# Altium schematic sheet Control System.SchDoc
size A4; DocumentNumber: 2; SheetNumber: 2; SheetTotal: 2
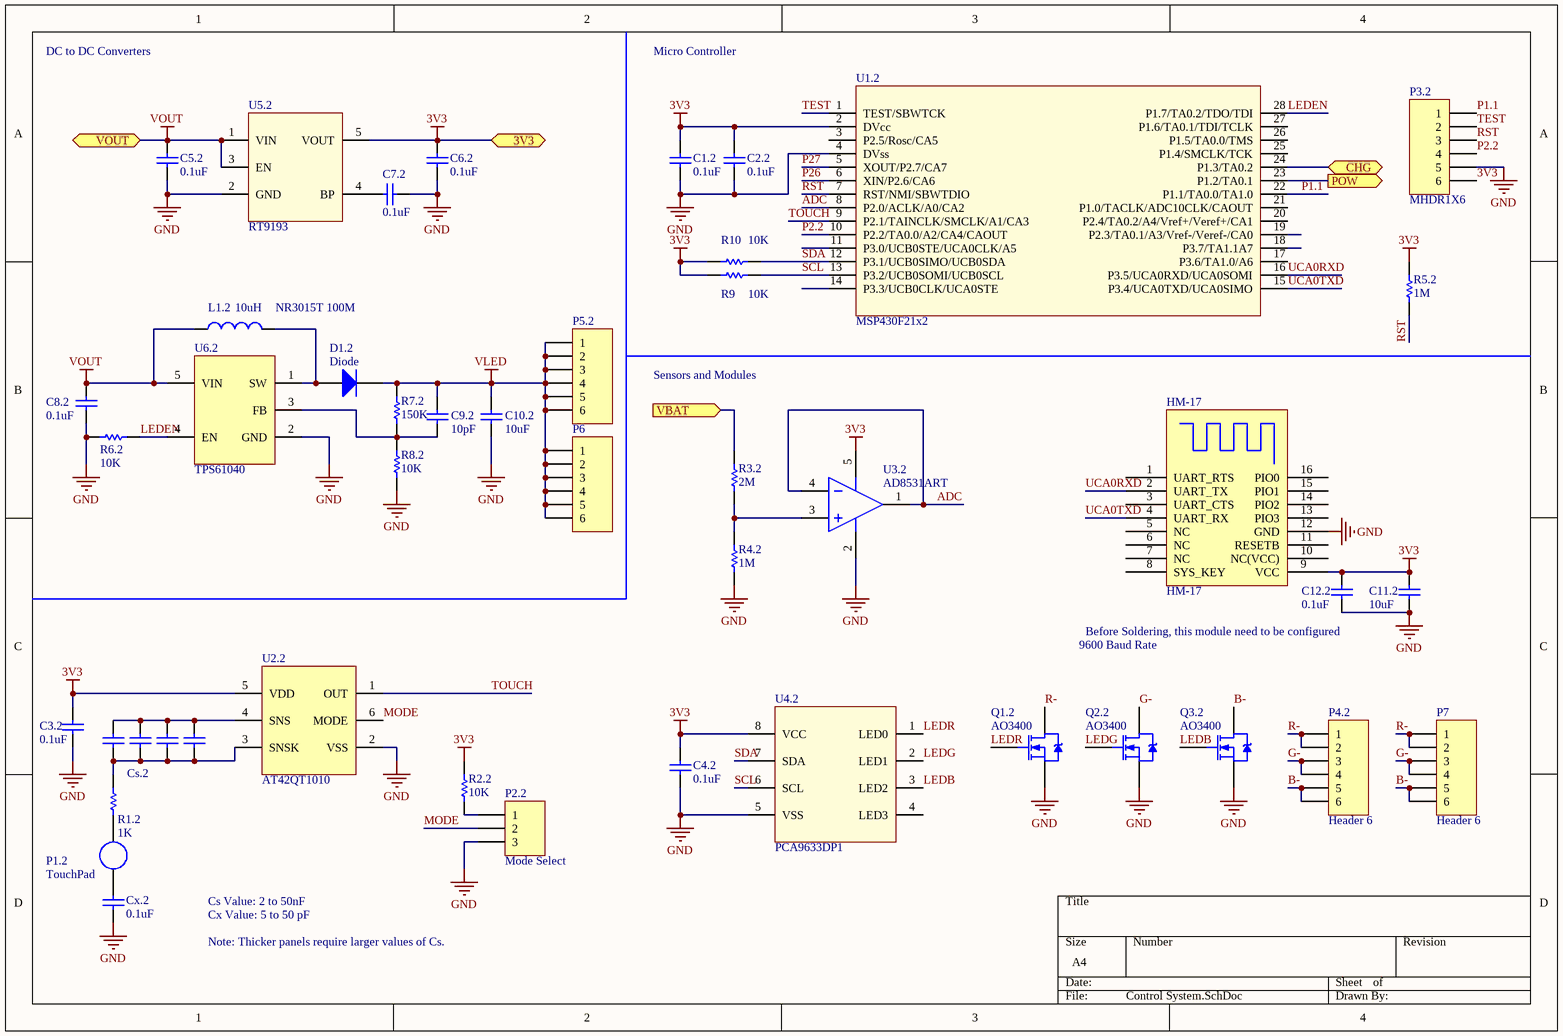
[diagram p0: Control System.SchDoc]

## Parts
C1.2  value 0.1uF  [D0603]  (hidden comment: 0603)
C2.2  value 0.1uF  [D0603]  (hidden comment: 0603)
C3.2  value 0.1uF  [D0603]  (hidden comment: 0603)
C4.2  value 0.1uF  [D0603]  (hidden comment: 0603)
C5.2  value 0.1uF  [D0603]  (hidden comment: 0603)
C6.2  value 0.1uF  [D0603]  (hidden comment: 0603)
C7.2  value 0.1uF  [D0603]  (hidden comment: 0603)
C8.2  value 0.1uF  [D0603]  (hidden comment: 0603)
C9.2  value 10pF  [D0603]  (hidden comment: 0603)
C10.2  value 10uF  [D0805]  (hidden comment: 0603)
C11.2  value 10uF  [D0603]  (hidden comment: 0603)
C12.2  value 0.1uF  [D0603]  (hidden comment: 0603)
Cs1  0603  [D0603]  (value not drawn)
Cs2  0603  [D0603]  (value not drawn)
Cs3  0603  [D0603]  (value not drawn)
Cs.2  0603  [D0603]  (value not drawn)
Cx.2  value 0.1uF  [D0603]  (hidden comment: 0603)
D1.2  Diode  [DO214AC_SMA]
HM-17  HM-17  [HM_05_06_07_11_13_17]
L1.2  NR3015T 100M  value 10uH  [Inductor.3030]
P1.2  TouchPad  [HDR1X2 1.27]
P2.2  Mode Select  [HDR1X3 1.27]
P3.2  MHDR1X6  [HDR1X6 1.27]
P4.2  Header 6  [HDR1X6 1.27]
P5.2  Header 6  [HDR1X6 1.27]  (value not drawn)
P6  Header 6  [HDR1X6 1.27]  (value not drawn)
P7  Header 6  [HDR1X6 1.27]
Q1.2  AO3400  [SOT23_N]
Q2.2  AO3400  [SOT23_N]
Q3.2  AO3400  [SOT23_N]
R1.2  value 1K  [D0603]  (hidden comment: 0603)
R2.2  value 10K  [D0603]  (hidden comment: 0603)
R3.2  value 2M  [D0603]  (hidden comment: 0603)
R4.2  value 1M  [D0603]  (hidden comment: 0603)
R5.2  value 1M  [D0603]  (hidden comment: 0603)
R6.2  value 10K  [D0603]  (hidden comment: 0603)
R7.2  value 150K  [D0603]  (hidden comment: 0603)
R8.2  value 10K  [D0603]  (hidden comment: 0603)
R9  value 10K  [D0603]  (hidden comment: 0603)
R10  value 10K  [D0603]  (hidden comment: 0603)
U1.2  MSP430F21x2  [TSSOP28]
U2.2  AT42QT1010  [SOT23-6]
U3.2  AD8531ART  [SOT23-5]
U4.2  PCA9633DP1  [TSSOP8]
U5.2  RT9193  [SC70-5]
U6.2  TPS61040  [SOT23-5]

## Ports
3V3, CHG, POW, VBAT, VOUT

## Nets
3V3: C1.2.2 C2.2.2 C3.2.2 C4.2.2 C6.2.2 C11.2.1 C12.2.1 HM-17.9(VCC) P3.2.6 R2.2.2 R5.2.2 R9.2 R10.2 U1.2.2(DVcc) U2.2.5(VDD) U3.2.5(V+) U4.2.8(VCC) U5.2.5(VOUT) ; port 3V3
GND: C1.2.1 C2.2.1 C3.2.1 C4.2.1 C5.2.1 C6.2.1 C7.2.1 C8.2.2 C10.2.2 C11.2.2 C12.2.2 Cx.2.1 HM-17.12(GND) P2.2.3 P3.2.5 Q1.2.3(S) Q2.2.3(S) Q3.2.3(S) R4.2.1 R6.2.2 R8.2.1 U1.2.4(DVss) U2.2.2(VSS) U3.2.2(V-) U4.2.5(VSS) U5.2.2(GND) U6.2.2(GND)
VLED: C9.2.1 C10.2.1 D1.2.2(K) P5.2.1 P5.2.2 P5.2.3 P5.2.4 P5.2.5 P5.2.6 P6.1 P6.2 P6.3 P6.4 P6.5 P6.6 R7.2.1
VOUT: C5.2.2 C8.2.1 L1.2.1 U5.2.1(VIN) U5.2.3(EN) U6.2.5(VIN) ; port VOUT
ADC: U1.2.8(P2.0/ACLK/A0/CA2) U3.2.1(OUT) U3.2.4(IN-)
B-: P4.2.5 P4.2.6 P7.5 P7.6 Q3.2.2(D)
CHG: U1.2.24(P1.3/TA0.2) ; port CHG
G-: P4.2.3 P4.2.4 P7.3 P7.4 Q2.2.2(D)
LEDB: Q3.2.1(G) U4.2.3(LED2)
LEDEN: R6.2.1 U1.2.28(P1.7/TA0.2/TDO/TDI) U6.2.4(EN)
LEDG: Q2.2.1(G) U4.2.2(LED1)
LEDR: Q1.2.1(G) U4.2.1(LED0)
MODE: P2.2.2 U2.2.6(MODE)
P1.1: P3.2.1 U1.2.22(P1.1/TA0.0/TA1.0)
P2.2: P3.2.4 U1.2.10(P2.2/TA0.0/A2/CA4/CAOUT)
P26: U1.2.6(XIN/P2.6/CA6)
P27: U1.2.5(XOUT/P2.7/CA7)
POW: U1.2.23(P1.2/TA0.1) ; port POW
R-: P4.2.1 P4.2.2 P7.1 P7.2 Q1.2.2(D)
RST: P3.2.3 R5.2.1 U1.2.7(RST/NMI/SBWTDIO)
SCL: R9.1 U1.2.13(P3.2/UCB0SOMI/UCB0SCL) U4.2.6(SCL)
SDA: R10.1 U1.2.12(P3.1/UCB0SIMO/UCB0SDA) U4.2.7(SDA)
TEST: P3.2.2 U1.2.1(TEST/SBWTCK)
TOUCH: U1.2.9(P2.1/TAINCLK/SMCLK/A1/CA3) U2.2.1(OUT)
UCA0RXD: HM-17.2(UART_TX) U1.2.16(P3.5/UCA0RXD/UCA0SOMI)
UCA0TXD: HM-17.4(UART_RX) U1.2.15(P3.4/UCA0TXD/UCA0SIMO)
VBAT: R3.2.2 ; port VBAT
NetC7.2_2: C7.2.2 U5.2.4(BP)
NetC9.2_2: C9.2.2 R7.2.2 R8.2.2 U6.2.3(FB)
NetCs1_1: Cs1.1 Cs2.1 Cs3.1 Cs.2.1 U2.2.4(SNS)
NetCs1_2: Cs1.2 Cs2.2 Cs3.2 Cs.2.2 R1.2.1 U2.2.3(SNSK)
NetCx.2_2: Cx.2.2 P1.2.2(Node)
NetD1.2_1: D1.2.1(A) L1.2.2 U6.2.1(SW)
NetP1.2_1: P1.2.1(Node) R1.2.2
NetP2.2_1: P2.2.1 R2.2.1
NetR3.2_1: R3.2.1 R4.2.2 U3.2.3(IN+)

Not connected (* = marked no-connect by the designer): HM-17 1(UART_RTS) 3(UART_CTS) 5(NC) 6(NC) 7(NC) 8(SYS_KEY) 10(NC(VCC)) 11(RESETB) 13(PIO3) 14(PIO2) 15(PIO1) 16(PIO0); U1.2 3(P2.5/Rosc/CA5) 11(P3.0/UCB0STE/UCA0CLK/A5) 14(P3.3/UCB0CLK/UCA0STE) 17(P3.6/TA1.0/A6) 18(P3.7/TA1.1A7) 19(P2.3/TA0.1/A3/Vref-/Veref-/CA0) 20(P2.4/TA0.2/A4/Vref+/Veref+/CA1) 21(P1.0/TACLK/ADC10CLK/CAOUT) 25(P1.4/SMCLK/TCK) 26(P1.5/TA0.0/TMS) 27(P1.6/TA0.1/TDI/TCLK); U4.2 4(LED3)

## Notes on the sheet
- DC to DC Converters
- Micro Controller
- Sensors and Modules
- 9600 Baud Rate
- Before Soldering, this module need to be configured
- Cs Value: 2 to 50nF
- Cx Value: 5 to 50 pF
- Note: Thicker panels require larger values of Cs.

## Library data of the parts
C1.2 C2.2 C3.2 C4.2 C5.2 C6.2 C7.2 C8.2 C9.2 C10.2 C11.2 C12.2 Cx.2 = Cap: Capacitor; Published: 8-Jun-2000; LatestRevisionDate: 17-Jul-2002; LatestRevisionNote: Re-released for DXP Platform.; PackageReference: RAD-0.3; Publisher: Altium Limited; PackageDescription: Radial Cap, Thru-Hole; 2 Leads; 0.3 in Pin Spacing
Cs1-Cs3 Cs.2 = Cap: Capacitor; Value: 0.1uF; Published: 8-Jun-2000; LatestRevisionDate: 17-Jul-2002; LatestRevisionNote: Re-released for DXP Platform.; PackageReference: RAD-0.3; Publisher: Altium Limited; PackageDescription: Radial Cap, Thru-Hole; 2 Leads; 0.3 in Pin Spacing
D1.2 = Diode: Default Diode; Published: 8-Jun-2000; LatestRevisionDate: 17-Jul-2002; LatestRevisionNote: Re-released for DXP Platform.; PackageVersion: Sep-1996; PackageReference: SMC; Publisher: Altium Limited; PackageDescription: DO-214-AB/SMC; 2 C-Bend Leads; Body 7.9 x 5.9 mm, inc. leads (LxW); Code_JEDEC: DO-214-AB
L1.2 = Inductor: Code_IEC: 1005; Published: 8-Jun-2000; LatestRevisionDate: 29-May-2009; LatestRevisionNote: IPC-7351 Footprint Added.; PackageReference: 0402-A; Publisher: Altium Limited; PackageDescription: Chip Inductor; Code_JEITA: 0402
P2.2 = Header 3: Header, 3-Pin; LatestRevisionDate: 17-Jul-2002; LatestRevisionNote: Re-released for DXP Platform.; Publisher: Altium Limited
P3.2 = MHDR1X6: Header, 6-Pin; LatestRevisionDate: 17-Jul-2002; LatestRevisionNote: Re-released for DXP Platform.; Publisher: Altium Limited
P4.2 P5.2 P6 P7 = Header 6: Header, 6-Pin; LatestRevisionDate: 17-Jul-2002; LatestRevisionNote: Re-released for DXP Platform.; Publisher: Altium Limited
Q1.2 Q2.2 Q3.2 = NMOS-2: N-Channel Power MOSFET; Note: Pin 2 is electrically connected to pin 4.; Published: 8-Jun-2000; LatestRevisionDate: 17-Jul-2002; LatestRevisionNote: Re-released for DXP Platform.; DatasheetVersion: PD-9.814; PackageVersion: Feb-1997; PackageReference: TO-220AB; Publisher: Altium Limited; PackageDescription: TO, Thru-Hole, Vertical, Heatsink Mounted; 3 In-Line Leads; Pitch 2.54 mm; ComponentLink1Description: Manufacturer Link; ComponentLink1URL: http://www.irf.com/
R1.2 R2.2 R3.2 R4.2 R5.2 R6.2 R7.2 R8.2 R9 R10 = Res1: Resistor; Published: 8-Jun-2000; LatestRevisionDate: 17-Jul-2002; LatestRevisionNote: Re-released for DXP Platform.; PackageReference: AXIAL-0.3; Publisher: Altium Limited; PackageDescription: Axial Device, Thru-Hole; 2 Leads; 0.3 in Pin Spacing
U1.2 = MSP430F21x2_PW
U2.2 = AT42QT1010: AT42QT1010 SOT23-6; Package: SOT23
U3.2 = AD8531ART: Low Cost, 250 mA Output Single-Supply Amplifier; Published: 8-Jun-2000; LatestRevisionDate: 19-Mar-2004; LatestRevisionNote: Unsupported parameters removed from SIM model file.; DatasheetVersion: REV. A 1997; PackageReference: RT-5; Publisher: Altium Limited; PackageDescription: SOT-23/SC-74A; 5 Leads; Body 3.1 x 3 mm, inc. leads (LxW max); Code_JEDEC: MO-178AA; ComponentLink1Description: Manufacturer Link; ComponentLink1URL: http://www.analog.com/en/prod/0,,759_786_AD8531%2C00.html; ComponentLink2Description: Datasheet; ComponentLink2URL: http://www.analog.com/UploadedFiles/Data_Sheets/93565307AD8531_2_4_E.pdf
U5.2 = RT9193: 3V3 Voltage Regulator